# Altium schematic sheet BlockChart.SchDoc
size A4; SheetNumber: 1; SheetTotal: 7
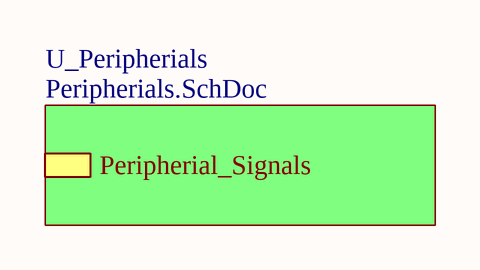
[diagram p0: BlockChart.SchDoc]

## Sub-sheets
U_Peripherials = Peripherials.SchDoc: Peripherial_Signals (harness Peripherial_Signals)